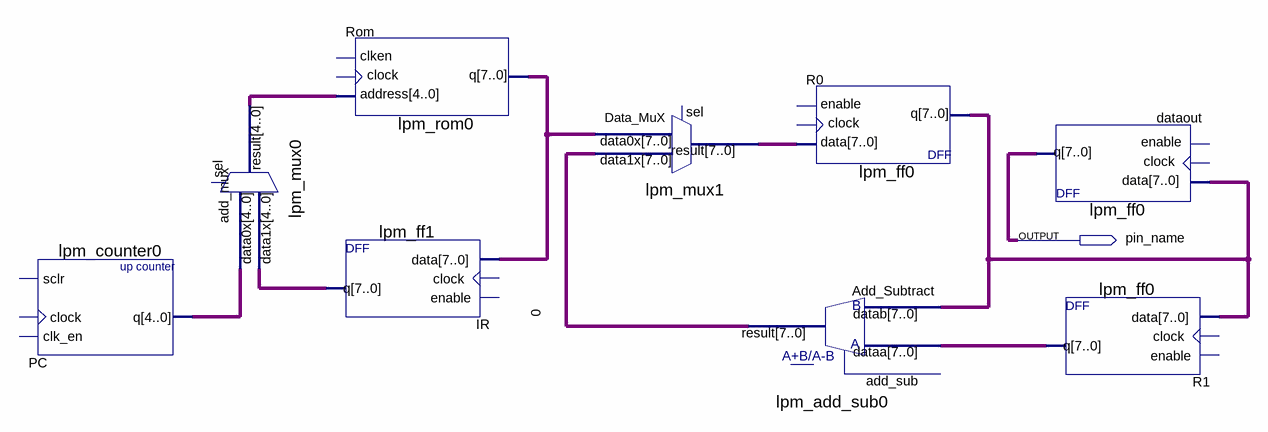
[diagram p0: schematic sheet]
// Quartus schematic Processor.bdf as structural Verilog: 9 symbols, 1 pins
module Processor (
  output pin_name
);

  wire \0 ;
  wire [4:0] add_mux_result, PC_q;
  wire [7:0] Add_Subtract_result, Data_MuX_result, dataout_q, IR_q, R0_q, R1_q;

  lpm_counter0 PC (.q(PC_q));  // open: sclr, clock, clk_en
  lpm_mux0 add_mux (.data1x(IR_q), .data0x(PC_q), .result(add_mux_result));  // open: sel
  lpm_rom0 Rom (.address(add_mux_result), .q(\0 ));  // open: clock, clken
  lpm_ff1 IR (.data({8{\0 }}), .q(IR_q));  // open: clock, enable
  lpm_mux1 Data_MuX (.data1x(Add_Subtract_result), .data0x({8{\0 }}), .result(Data_MuX_result));  // open: sel
  lpm_add_sub0 Add_Subtract (.dataa(R1_q), .datab(R0_q), .result(Add_Subtract_result));  // open: add_sub
  lpm_ff0 R0 (.data(Data_MuX_result), .q(R0_q));  // open: clock, enable
  lpm_ff0 dataout (.data(R0_q), .q(dataout_q));  // open: clock, enable
  lpm_ff0 R1 (.data(R0_q), .q(R1_q));  // open: clock, enable
endmodule
